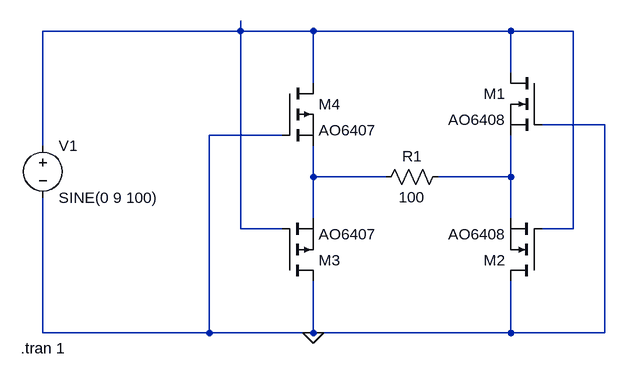
[diagram p0: schematic grec.asc]
grec.asc, the LTspice schematic file:
Version 4
SHEET 1 880 680
WIRE -272 0 -272 -16
WIRE -272 0 -576 0
WIRE -160 0 -272 0
WIRE 144 0 -160 0
WIRE 240 0 144 0
WIRE 144 64 144 0
WIRE -160 80 -160 0
WIRE 288 144 192 144
WIRE -208 160 -320 160
WIRE -576 176 -576 0
WIRE -160 224 -160 176
WIRE -48 224 -160 224
WIRE 144 224 144 160
WIRE 144 224 32 224
WIRE -160 288 -160 224
WIRE 144 288 144 224
WIRE -272 304 -272 0
WIRE -208 304 -272 304
WIRE 240 304 240 0
WIRE 240 304 192 304
WIRE -576 464 -576 256
WIRE -320 464 -320 160
WIRE -320 464 -576 464
WIRE -160 464 -160 384
WIRE -160 464 -320 464
WIRE 144 464 144 384
WIRE 144 464 -160 464
WIRE 288 464 288 144
WIRE 288 464 144 464
FLAG -160 464 0
SYMBOL nmos 192 64 M0
SYMATTR InstName M1
SYMATTR Value AO6408
SYMBOL nmos 192 384 R180
SYMATTR InstName M2
SYMATTR Value AO6408
SYMBOL pmos -208 384 M180
SYMATTR InstName M3
SYMATTR Value AO6407
SYMBOL pmos -208 80 R0
SYMATTR InstName M4
SYMATTR Value AO6407
SYMBOL voltage -576 160 R0
WINDOW 123 0 0 Left 0
WINDOW 39 0 0 Left 0
SYMATTR InstName V1
SYMATTR Value SINE(0 9 100)
SYMBOL res 48 208 R90
WINDOW 0 0 56 VBottom 2
WINDOW 3 32 56 VTop 2
SYMATTR InstName R1
SYMATTR Value 100
TEXT -610 488 Left 2 !.tran 1

The netlist it stands for:
* grec.asc
M1 N001 0 N003 N003 AO6408
M2 0 N001 N003 N003 AO6408
M3 0 N001 N002 N002 AO6407
M4 N001 0 N002 N002 AO6407
V1 N001 0 SINE(0 9 100)
R1 N003 N002 100
.model NMOS NMOS
.model PMOS PMOS
.lib standard.mos
.tran 1
.backanno
.end